# Altium project Smartfin Main PCBA.PrjPcb (part 2 of 2)

## Sheet Smartfin Main PCBA Wet Dry Sensor.SchDoc: Wet Dry Sensor
size Tabloid; TOCFontName: Consolas; TOCFontSize: 24; TOCFontColor: 0; TOCFontAttributes: 0; TOCMaxLinesInTable: 25; TOCVerticalOffset: 200; TOCHorizontalOffset: 500; TOCHorizontalSeparation: 800; TOCVerticalSeparation: 30; TOCHorizTableSize: 640; Engineer: Amy Domino; DocumentNumber: 644-001-023; Revision: A; SheetNumber: 9; SheetTotal: 9; PageSetup: Record=PageOptions|CenterHorizontal=True|CenterVertical=True|PrintScale=0.96|XCorrection=1.00|YCorrection=1.00|PrintKind=0|BorderSize=5000000|LeftOffset=0|BottomOffset=0|Orientation=2|PaperLength=1000|PaperWidth=1000|Scale=100|PaperSource=7|PrintQuality=-4|MediaType=1|DitherType=10|PaperKind=11" x 17"|PrintScaleMode=1
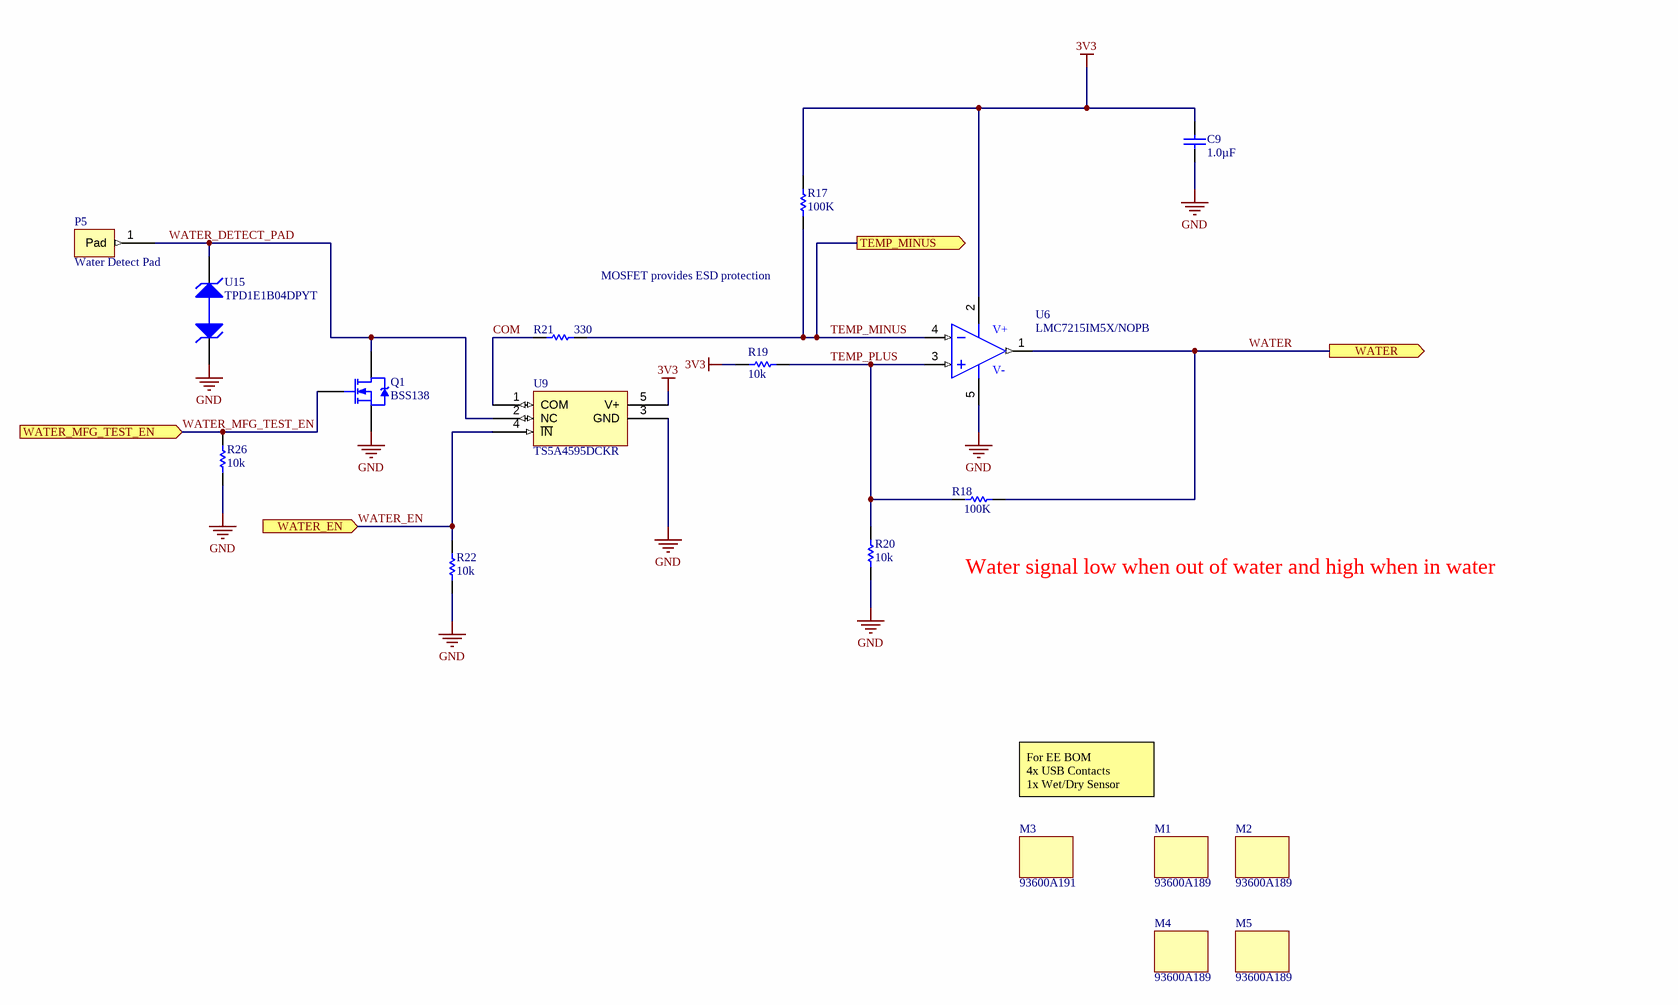
[diagram p4: Smartfin Main PCBA Wet Dry Sensor.SchDoc]

### Parts
C9  1.0µF  [CAPC0402(1005)60_N]
M1  93600A189  (mechanical)
M2  93600A189  (mechanical)
M3  93600A191  (mechanical)
M4  93600A189  (mechanical)
M5  93600A189  (mechanical)
P5  Water Detect Pad  [Water Detect Pad-Footprint-1]  (no BOM)
Q1  BSS138  [SOT95P251X112-3N]
R17  100K  [RESC1005X04N]
R18  100K  [RESC1005X04N]
R19  10k  [RESC0402(1005)_N]
R20  10k  [RESC0402(1005)_N]
R21  330  [RESC1005X04N]
R22  10k  [RESC0402(1005)_N]
R26  10k  [RESC0402(1005)_N]
U6  LMC7215IM5X/NOPB  [LMC7215IM5X_NOPB-Footprint-1]
U9  TS5A4595DCKR  [TS5A4595DCKR-Footprint-1]
U15  TPD1E1B04DPYT  [TPD1E10B06DPYT-Footprint-1]

### Ports
TEMP_MINUS (out), WATER (out), WATER_EN (in), WATER_MFG_TEST_EN (in)

### Nets
3V3: C9.2 R17.2 R19.2 U6.2(V+) U9.5(V+)
GND: C9.1 Q1.S R20.1 R22.1 R26.1 U6.5(V-) U9.3(GND) U15.2
COM: R21.1 U9.1(COM)
TEMP_MINUS: R17.1 R21.2 U6.4(IN-) ; port TEMP_MINUS
TEMP_PLUS: R18.2 R19.1 R20.2 U6.3(IN+)
WATER: R18.1 U6.1(OUT) ; port WATER
WATER_DETECT_PAD: P5.1(Pad) Q1.D U9.2(NC) U15.1
WATER_EN: R22.2 U9.4(~{IN}) ; port WATER_EN
WATER_MFG_TEST_EN: Q1.G R26.2 ; port WATER_MFG_TEST_EN

### Notes on the sheet
- MOSFET provides ESD protection
- Water signal low when out of water and high when in water
- For EE BOM
  4x USB Contacts
  1x Wet/Dry Sensor Contact
- TITLE
- DOC NUMBER
- VARIANT
- REV
- 10875 dover st, suite 500
  westminster, co, 80021, usa
  syncroness.com
- FILE
- ENGINEER
- SHEET
- DATE
- OF
- THIS DOCUMENT IS CONFIDENTIAL AND THE PROPERTY OF SYNCRONESS, INC. AND ITS SUBSIDARIES. IT SHALL NOT BE REPRODUCED IN ANY MANNER NOR USED FOR ANY PURPOSE WHATSOEVER EXCEPT AS SPECIFIED IN WRITING BY SYNCRONESS, INC.

### Library data of the parts
C9 = CMP-13694-A.6: CAP CER 1UF 10V 10% X5R 0402; Manufacturer: Yageo; Manufacturer Part Number: CC0402KRX5R6BB105; Manufacturer 2: Samsung Electro-Mechanics; Manufacturer 3: AVX Corporation; Manufacturer Part Number 2: CL05A105KP5NNNC; Manufacturer Part Number 3: 0402ZD105KAT2A; Operating Temperature: -55°C ~ 85°C; Supplier Part Number 1: 311-1439-1-ND; Supplier Part Number 2: 1276-1076-1-ND; Supplier Part Number 3: 478-4596-1-ND; Temperature Coefficient: X5R; Tolerance: ±10%; Capacitance: 1.0µF; Voltage - Rated: 10V; Supplier 2: Digi-Key; Supplier 3: Digi-Key; Supplier 1: Digi-Key; Datasheet: http://www.samsungsem.com/kr/support/product-search/mlcc/__icsFiles/afieldfile/2019/05/10/19-CL05A105KP5NNNC.pdf
M1 M2 M4 M5 = CMP-23775-A.4: 316 Stainless Steel Dowel Pin, 2mm Diameter, 6mm Long; Manufacturer: McMASTER-Carr; Manufacturer Part Number: 93600A189; Supplier: McMASTER-Carr; Supplier Part Number: 93600A189; Length: 6mm; Diameter: 2mm
M3 = CMP-23885-A.4: 316 Stainless Steel Dowel Pin, 2mm Diameter, 8mm Long; Manufacturer: McMASTER-Carr; Manufacturer Part Number: 93600A191; Supplier: McMASTER-Carr; Supplier Part Number: 93600A191; Length: 8mm; Diameter: 2mm
P5 = CMP-23706-A.3
Q1 = CMP-08418-A.8: MOSFET N-CH 50V 220MA SOT-23; Manufacturer: Fairchild Semiconductor; FET Type: MOSFET N-Channel, Metal Oxide; FET Feature: Logic Level Gate; Current - Continuous Drain (Id) @ 25°C: 220mA (Ta); Rds On (Max) @ Id, Vgs: 3.5 Ohm @ 220mA, 10V; Vgs(th) (Max) @ Id: 1.5V @ 1mA; Gate Charge (Qg) @ Vgs: 2.4nC @ 10V; Input Capacitance (Ciss) @ Vds: 27pF @ 25V; Power - Max: 360mW; Supplier 1: Digi-Key; Supplier Part Number 1: BSS138CT-ND; Manufacturer Part Number: BSS138; RoHS: RoHS Compliant; Category: Discrete Semiconductor Products; Packaging: Cut Tape (CT); Drain to Source Voltage (Vdss): 50V; Mounting Type: Surface Mount; Package / Case: TO-236-3, SC-59, SOT-23-3; Supplier Device Package: SOT-23-3; ComponentLink1URL: http://www.fairchildsemi.com/ds/BS/BSS138.pdf; ComponentLink1Description: Datasheet
R17 R18 = CMP-22582-A.1: RES SMD 100K OHM 1% 1/16W 0402; Manufacturer: Vishay Dale; Manufacturer Part Number: CRCW0402100KFKED; Power (Watts): 0.063W, 1/16W; Temperature Coefficient: ±100ppm/°C; Resistance: 100 kOhms; ComponentLink1Description: Datasheet; ComponentLink1URL: http://www.vishay.com/docs/20035/dcrcwe3.pdf; Composition: Thick Film; Features: AEC-Q200; Height - Seated (Max): 0.016" (0.40mm); Operating Temperature: -55°C ~ 155°C; Package / Case: 0402 (1005 Metric); Size / Dimension: 0.039" L x 0.020" W (1.00mm x 0.50mm); Supplier: Digi-Key; Supplier Part Number: 541-100KLCT-ND; Tolerance: ±1%
R19 R20 R22 R26 = CMP-15831-A.1: RES SMD 10K OHM 0.1% 1/16W 0402; Manufacturer: Panasonic Electronic Components; Manufacturer Part Number: ERA-2ARB103X; Power (Watts): 0.063W, 1/16W; Temperature Coefficient: ±10ppm/°C; Packaging: Cut Tape (CT); Part Status: Active; Resistance (Ohms): 10k; Tolerance: ±0.1%; Composition: Thin Film; Features: Automotive AEC-Q200; Operating Temperature: -55°C ~ 155°C; Package / Case: 0402 (1005 Metric); Supplier Device Package: 0402; Size / Dimension: 0.039" L x 0.020" W (1.00mm x 0.50mm); Height - Seated (Max): 0.016" (0.40mm); Failure Rate: -; Supplier: Digi-Key; Supplier Part Number: P10KCPCT-ND; ComponentLink1Description: Datasheet; ComponentLink1URL: https://industrial.panasonic.com/cdbs/www-data/pdf/RDM0000/AOA0000C237.pdf
R21 = CMP-22585-A.1: RES SMD 330 OHM 1% 1/16W 0402; Manufacturer: Vishay Dale; Manufacturer Part Number: CRCW0402330RFKED; Power (Watts): 0.063W, 1/16W; Temperature Coefficient: ±100ppm/°C; Resistance: 330 Ohms; ComponentLink1Description: Datasheet; ComponentLink1URL: http://www.vishay.com/docs/20035/dcrcwe3.pdf; Composition: Thick Film; Features: AEC-Q200; Height - Seated (Max): 0.016" (0.40mm); Operating Temperature: -55°C ~ 155°C; Package / Case: 0402 (1005 Metric); Size / Dimension: 0.039" L x 0.020" W (1.00mm x 0.50mm); Supplier: Digi-Key; Supplier Part Number: 541-330LCT-ND; Tolerance: ±1%
U6 = CMP-23700-A.7: Comparator Single 8V 5-Pin SOT-23 T/R; Manufacturer: Texas Instruments; Nominal Supply Current: 1uA; Common Mode Rejection Ratio: 80dB; Min Supply Voltage: 2V; Voltage Gain: 140dB; Number of Elements: 1; Input Offset Voltage (Vos): 6mV; Output Current: 30mA; Propagation Delay: 24us; Input Bias Current: 5pA; Power Supply Rejection Ratio (PSRR): 90dB; Mount: Surface Mount; Case/Package: SOT-23; Number of Pins: 5; Contact Plating: Tin,Matte; Min Operating Temperature: -40°C; Max Operating Temperature: 85°C; Max Supply Voltage: 8V; Packaging: Tape and Reel; Package Quantity: 3000; Quiescent Current: 1uA; Max Supply Current: 1uA; Number of Channels: 1; Response Time: 24us; Type: General Purpose; Radiation Hardening: No; Lead Free: Lead Free; Manufacturer Part Number: LMC7215IM5X/NOPB; Supplier: Digi-Key; Supplier Part Number: 296-35219-1-ND
U9 = CMP-23699-A.6: IC, ANALOG SWITCH 5V SC70-5; Manufacturer: Texas Instruments; Number of Channels: 1; Bandwidth: 450MHz; Max Supply Voltage: 5.5V; Min Supply Voltage: 2V; On-State Resistance: 8R; Operating Supply Current: 10nA; Turn-On Delay Time: 17ns; Turn-Off Delay Time: 14ns; Max Supply Current: 250nA; Throw Configuration: SPST; Supply Type: Single; Polarity: Non-Inverting; High Level Output Current: 20mA; Mount: Surface Mount; Case/Package: SC; Number of Pins: 5; Weight: 8.8E-05oz; Contact Plating: Gold; Min Operating Temperature: -40°C; Max Operating Temperature: 85°C; Number of Inputs: 1; Number of Outputs: 1; Packaging: Tape and Reel; Package Quantity: 3000; Termination: SMD/SMT; Nominal Supply Current: 10nA; Number of Bits: 1; Low Level Output Current: 20mA; Length: 2mm; Height: 0.9mm; Width: 1.25mm; Radiation Hardening: No; REACH SVHC: No SVHC; Lead Free: Lead Free; Manufacturer Part Number: TS5A4595DCKR; Supplier: Digi-Key; Supplier Part Number: 296-17708-1-ND
U15 = CMP-23707-A.9: TVS DIODE 3.6V 8.5V 2X1SON; Manufacturer: Texas Instruments; Capacitance: 1pF; Interface: LVDS,USB,Ethernet; Number of Channels: 1; Min Operating Temperature: -40°C; Max Operating Temperature: 125°C; Lead Free: Lead Free; Manufacturer Part Number: TPD1E1B04DPYT; Supplier: Digi-Key; Supplier Part Number: 296-47364-1-ND; ComponentLink1Description: datasheet; ComponentLink1URL: https://www.ti.com/lit/ds/symlink/tpd1e1b04.pdf

## Nets that join several sheets
3V3: Smartfin Main PCBA Motion (9 pins), Smartfin Main PCBA GPS (C1.2 U3.8), Smartfin Main PCBA Control (23 pins), Smartfin Main PCBA Wet Dry Sensor (5 pins)
3v3SW: Smartfin Main PCBA GPS (C2.2 TP19.1 U3.1 U3.9), Smartfin Main PCBA Control (U2.5)
GND: Smartfin Main PCBA Motion (12 pins), Smartfin Main PCBA GPS (16 pins), Smartfin Main PCBA Control (40 pins), Smartfin Main PCBA USB (8 pins), Smartfin Main PCBA Wet Dry Sensor (8 pins)
VBUS: Smartfin Main PCBA Control (6 pins), Smartfin Main PCBA USB (6 pins)
DATA_N: Smartfin Main PCBA Control (U1.14), Smartfin Main PCBA USB (TP21.1 U5.2)
DATA_P: Smartfin Main PCBA Control (U1.13), Smartfin Main PCBA USB (TP22.1 U5.1)
GPS_RX: Smartfin Main PCBA GPS (R1.1), Smartfin Main PCBA Control (U1.49)
GPS_TX: Smartfin Main PCBA GPS (R2.1), Smartfin Main PCBA Control (U1.48)
IMU_INT: Smartfin Main PCBA Motion (Q2.D R44.1), Smartfin Main PCBA Control (TP25.1 U1.30)
SCL: Smartfin Main PCBA Motion (R3.1 U16.6), Smartfin Main PCBA Control (U1.41)
SDA: Smartfin Main PCBA Motion (R4.1 U16.5), Smartfin Main PCBA Control (U1.42)
TEMP_MINUS: Smartfin Main PCBA Control (R23.2), Smartfin Main PCBA Wet Dry Sensor (R17.1 R21.2 U6.4)
WATER: Smartfin Main PCBA Control (D6.A U1.28), Smartfin Main PCBA Wet Dry Sensor (R18.1 U6.1)
WATER_EN: Smartfin Main PCBA Control (U1.29), Smartfin Main PCBA Wet Dry Sensor (R22.2 U9.4)
WATER_MFG_TEST_EN: Smartfin Main PCBA Control (U1.23), Smartfin Main PCBA Wet Dry Sensor (Q1.G R26.2)

## Assembly variants
Smartfin Main PCBA - 2G/3G: not fitted J1 J3 R13 R23 R32 R34 R35 R36 R37 R39 U8
Smartfin Main PCBA - LTE: not fitted J1 J3 R23 R34 R37 R39; alternate parts U1 -> CMP-23692-A.9